# Altium project Gas Monitor.PrjPcb (part 1 of 2)
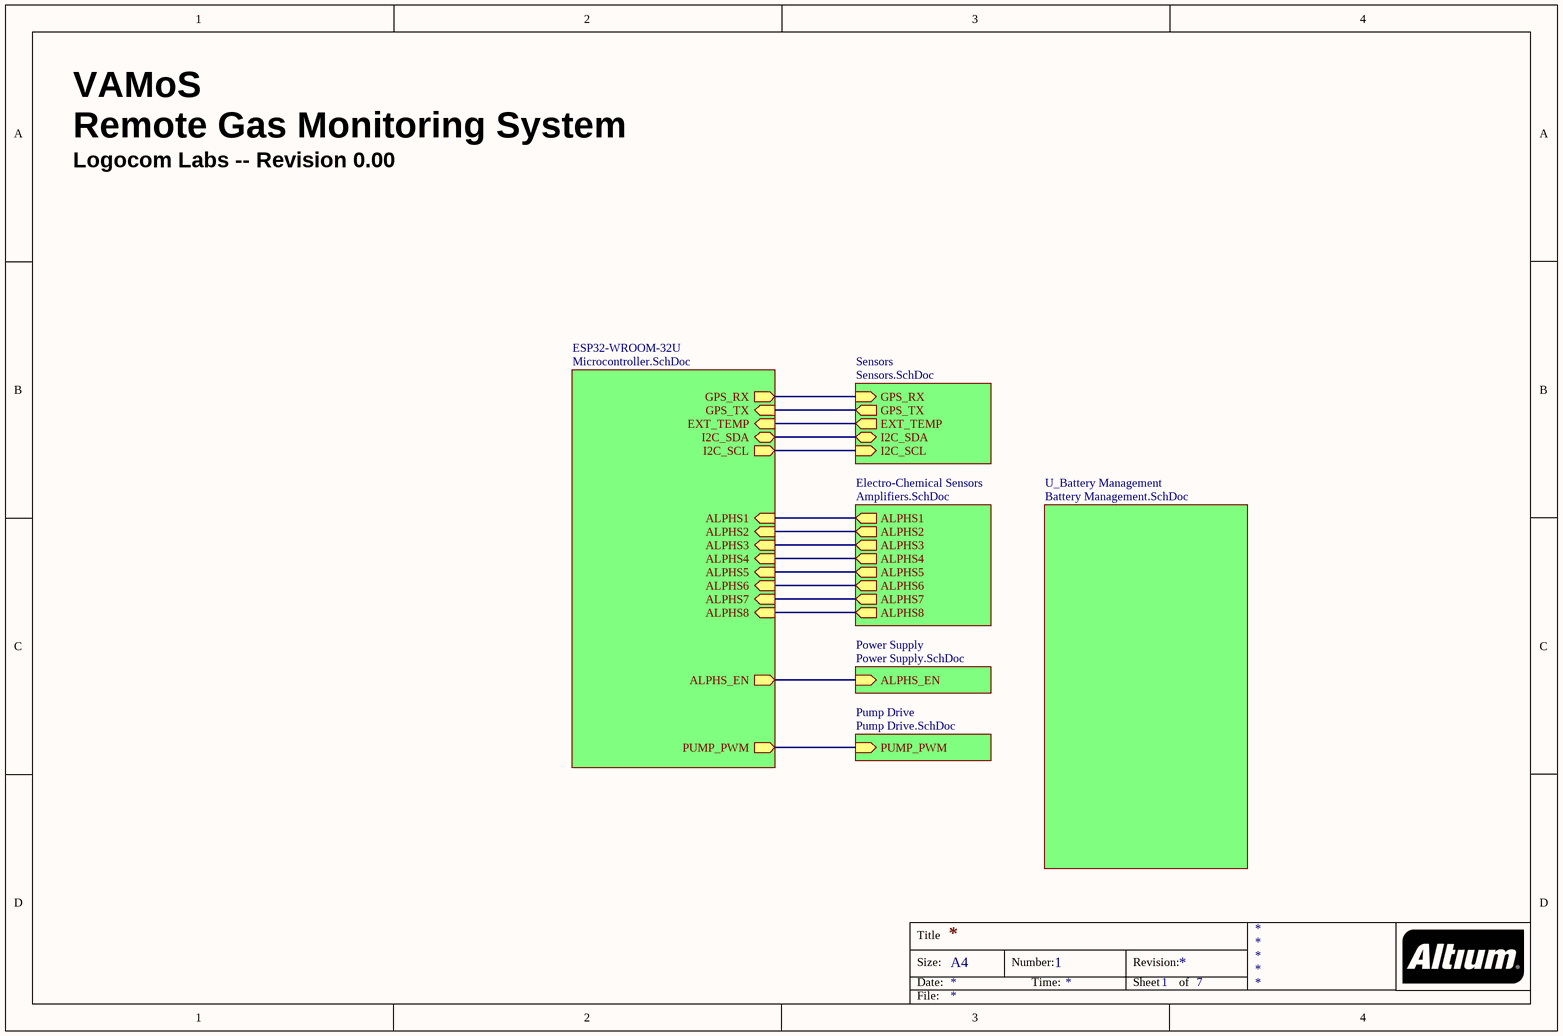
[diagram p0: VAMoS Top Sheet.SchDoc]
7 sheets, 294 parts. Net scope: hierarchical (ports join the sheet entries above them; power ports are global).
Board file: VAMoS Rev D.PcbDoc
Sheets:
  VAMoS Top Sheet.SchDoc
    Sensors = Sensors.SchDoc
    Electro-Chemical Sensors = Amplifiers.SchDoc
    Power Supply = Power Supply.SchDoc
    ESP32-WROOM-32U = Microcontroller.SchDoc
    Pump Drive = Pump Drive.SchDoc
    U_Battery Management = Battery Management.SchDoc

## Sheet VAMoS Top Sheet.SchDoc
size A4; DocumentNumber: 1; SheetNumber: 1; SheetTotal: 7

### Sub-sheets
Electro-Chemical Sensors = Amplifiers.SchDoc: ALPHS1 (out), ALPHS2 (out), ALPHS3 (out), ALPHS4 (out), ALPHS5 (out), ALPHS6 (out), ALPHS7 (out), ALPHS8 (out)
ESP32-WROOM-32U = Microcontroller.SchDoc: I2C_SDA (bidir), I2C_SCL (out), GPS_TX (in), GPS_RX (out), EXT_TEMP (in), ALPHS_EN (out), PUMP_PWM (out), ALPHS8 (in), ALPHS1 (in), ALPHS2 (in), ALPHS3 (in), ALPHS4 (in), ALPHS5 (in), ALPHS6 (in), ALPHS7 (in)
Power Supply = Power Supply.SchDoc: ALPHS_EN (in)
Pump Drive = Pump Drive.SchDoc: PUMP_PWM (in)
Sensors = Sensors.SchDoc: GPS_RX (in), GPS_TX (out), EXT_TEMP (out), I2C_SDA (bidir), I2C_SCL (in)
U_Battery Management = Battery Management.SchDoc: no entries

### Nets
ALPHS1: sheet Electro-Chemical Sensors/ALPHS1, sheet ESP32-WROOM-32U/ALPHS1
ALPHS2: sheet Electro-Chemical Sensors/ALPHS2, sheet ESP32-WROOM-32U/ALPHS2
ALPHS3: sheet Electro-Chemical Sensors/ALPHS3, sheet ESP32-WROOM-32U/ALPHS3
ALPHS4: sheet Electro-Chemical Sensors/ALPHS4, sheet ESP32-WROOM-32U/ALPHS4
ALPHS5: sheet Electro-Chemical Sensors/ALPHS5, sheet ESP32-WROOM-32U/ALPHS5
ALPHS6: sheet Electro-Chemical Sensors/ALPHS6, sheet ESP32-WROOM-32U/ALPHS6
ALPHS7: sheet Electro-Chemical Sensors/ALPHS7, sheet ESP32-WROOM-32U/ALPHS7
ALPHS8: sheet Electro-Chemical Sensors/ALPHS8, sheet ESP32-WROOM-32U/ALPHS8
ALPHS_EN: sheet Power Supply/ALPHS_EN, sheet ESP32-WROOM-32U/ALPHS_EN
EXT_TEMP: sheet Sensors/EXT_TEMP, sheet ESP32-WROOM-32U/EXT_TEMP
GPS_RX: sheet Sensors/GPS_RX, sheet ESP32-WROOM-32U/GPS_RX
GPS_TX: sheet Sensors/GPS_TX, sheet ESP32-WROOM-32U/GPS_TX
I2C_SCL: sheet Sensors/I2C_SCL, sheet ESP32-WROOM-32U/I2C_SCL
I2C_SDA: sheet Sensors/I2C_SDA, sheet ESP32-WROOM-32U/I2C_SDA
PUMP_PWM: sheet ESP32-WROOM-32U/PUMP_PWM, sheet Pump Drive/PUMP_PWM

### Notes on the sheet
- VAMoS
- Remote Gas Monitoring System
- Logocom Labs -- Revision 0.00
- Title
- Size:
- Date:
- A4
- Number:
- Time:
- Revision:
- Sheet
- of
- File:

## Sheet Sensors.SchDoc: Sensor Interfaces
size A4; DocumentNumber: 5; Revision: D; SheetNumber: 5; SheetTotal: 7
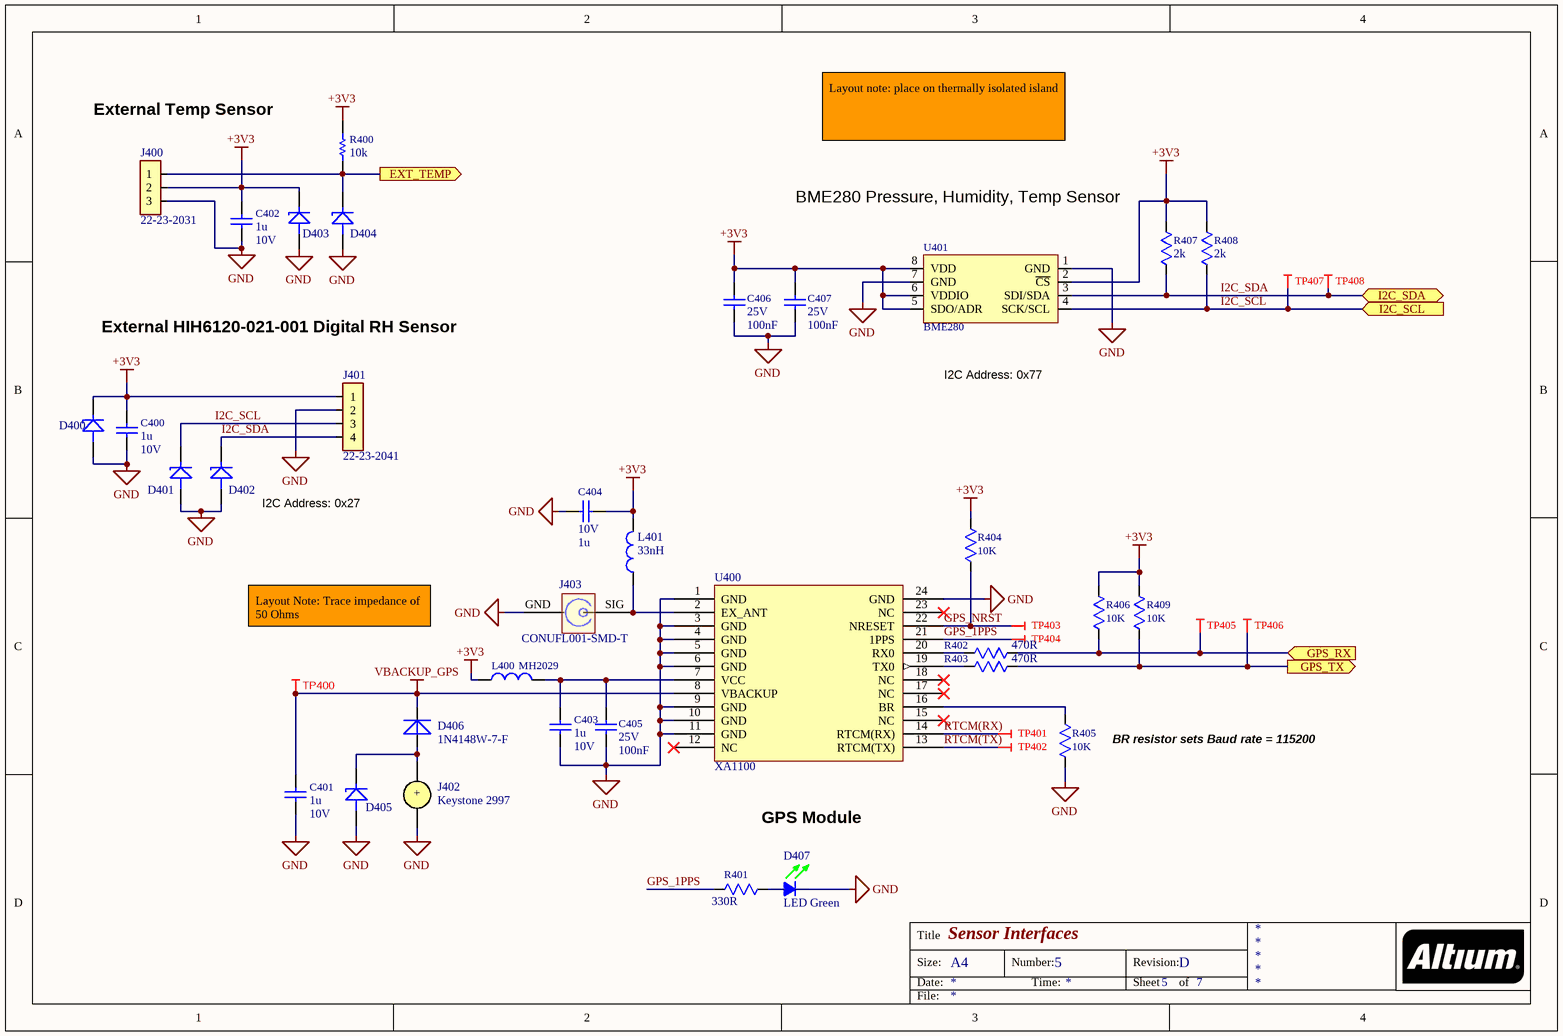
[diagram p1: Sensors.SchDoc]

### Parts
C400  value 1u  Voltage: 10V  [CAPC1005X06N]  (hidden comment: 4.7uF)
C401  value 1u  Voltage: 10V  [CAPC1005X06N]  (hidden comment: 4.7uF)
C402  value 1u  Voltage: 10V  [CAPC1005X06N]  (hidden comment: 4.7uF)
C403  value 1u  Voltage: 10V  [CAPC1005X06N]  (hidden comment: 4.7uF)
C404  value 1u  Voltage: 10V  [CAPC1005X06N]  (hidden comment: 4.7uF)
C405  value 100nF  Voltage: 25V  [CAPC1005X06N]  (hidden comment: 4.7uF)
C406  value 100nF  Voltage: 25V  [CAPC1005X06N]  (hidden comment: 4.7uF)
C407  value 100nF  Voltage: 25V  [CAPC1005X06N]  (hidden comment: 4.7uF)
D400  3.3V TVS  [NXP PTVSxS1UR-Series (SOD123W)]  (value not drawn)
D401  3.3V TVS  [NXP PTVSxS1UR-Series (SOD123W)]  (value not drawn)
D402  3.3V TVS  [NXP PTVSxS1UR-Series (SOD123W)]  (value not drawn)
D403  3.3V TVS  [NXP PTVSxS1UR-Series (SOD123W)]  (value not drawn)
D404  3.3V TVS  [NXP PTVSxS1UR-Series (SOD123W)]  (value not drawn)
D405  3.3V TVS  [NXP PTVSxS1UR-Series (SOD123W)]  (value not drawn)
D406  Manufacturer Part Number: 1N4148W-7-F  [SOD-123FL_TVS]  (hidden comment: 1N4148W-FDICT-ND)
D407  LED Green  [LED_0603]
J400  22-23-2031  [22-23-2031]
J401  22-23-2041  [22-23-2041]
J402  Keystone 2997  [2997 11.6mm COIN CELL]
J403  uFl Connector  [CONUFL001-SMD-T]  (value not drawn)
L400  MH2029  [L2012[0805]]
L401  33nH  [L1608[0603]]
R400  value 10k  [RESC1005X03N]  (hidden comment: RES: GENERAL)
R401  value 330R  [R1608[0603] small]  (hidden comment: 330)
R402  value 470R  [RESC1005X03N]  (hidden comment: 10K)
R403  value 470R  [RESC1005X03N]  (hidden comment: 10K)
R404  10K  [RESC1005X03N]
R405  10K  [RESC1005X03N]
R406  10K  [RESC1005X03N]
R407  value 2k  [R1005[0402]]  (hidden comment: 10K)
R408  value 2k  [R1005[0402]]  (hidden comment: 10K)
R409  10K  [RESC1005X03N]
TP400  PAD  [TP_SMD_39MIL]  (value not drawn)  (no BOM)
TP401  PAD  [TP_SMD_39MIL]  (value not drawn)  (no BOM)
TP402  PAD  [TP_SMD_39MIL]  (value not drawn)  (no BOM)
TP403  PAD  [TP_SMD_39MIL]  (value not drawn)  (no BOM)
TP404  PAD  [TP_SMD_45MIL]  (value not drawn)  (no BOM)
TP405  PAD  [TP_SMD_39MIL]  (value not drawn)  (no BOM)
TP406  PAD  [TP_SMD_39MIL]  (value not drawn)  (no BOM)
TP407  PAD  [TP_SMD_39MIL]  (value not drawn)  (no BOM)
TP408  PAD  [TP_SMD_39MIL]  (value not drawn)  (no BOM)
U400  XA1100  [XA1100]
U401  BME280  [BME280]

### Ports
EXT_TEMP (out), GPS_RX (in), GPS_TX (out), I2C_SCL (in), I2C_SDA (bidir)

### Nets
+3V3: C400.2 C402.2 C404.1 C406.2 C407.2 D400.1 D403.1 J400.2 J401.1 L400.1 L401.2 R400.2 R404.2 R406.2 R407.2 R408.2 R409.2 U401.2(~{CS}) U401.5(SDO/ADR) U401.6(VDDIO) U401.8(VDD)
GND: C400.1 C401.1 C402.1 C403.1 C404.2 C405.1 C406.1 C407.1 D400.2 D401.2 D402.2 D403.2 D404.2 D405.2 D407.2 J400.3 J401.2 J402.2 J403.GND R405.1 U400.1(GND) U400.3(GND) U400.4(GND) U400.5(GND) U400.6(GND) U400.9(GND) U400.10(GND) U400.11(GND) U400.24(GND) U401.1(GND) U401.7(GND)
VBACKUP_GPS: C401.2 D406.2 TP400.1 U400.8(VBACKUP)
EXT_TEMP: D404.1 J400.1 R400.1 ; port EXT_TEMP
GPS_1PPS: R401.2 TP404.1 U400.21(1PPS)
GPS_NRST: R404.1 TP403.1 U400.22(NRESET)
GPS_RX: R402.1 R406.1 TP405.1 ; port GPS_RX
GPS_TX: R403.1 R409.1 TP406.1 ; port GPS_TX
I2C_SCL: D401.1 J401.3 R408.1 TP407.1 U401.4(SCK/SCL) ; port I2C_SCL
I2C_SDA: D402.1 J401.4 R407.1 TP408.1 U401.3(SDI/SDA) ; port I2C_SDA
RTCM(RX): TP401.1 U400.14(RTCM(RX))
RTCM(TX): TP402.1 U400.13(RTCM(TX))
NetC403_2: C403.2 C405.2 L400.2 U400.7(VCC)
NetD405_1: D405.1 D406.1 J402.1(+)
NetD407_1: D407.1 R401.1
NetJ403_SIG: J403.SIG L401.1 U400.2(EX_ANT)
NetR402_2: R402.2 U400.20(RX0)
NetR403_2: R403.2 U400.19(TX0)
NetR405_2: R405.2 U400.16(BR)

Not connected (* = marked no-connect by the designer): U400 12(NC)* 15(NC)* 17(NC)* 18(NC)* 23(NC)*

### Notes on the sheet
- External Temp Sensor
- Layout note: place on thermally isolated island
- BME280 Pressure, Humidity, Temp Sensor
- External HIH6120-021-001 Digital RH Sensor
- I2C Address: 0x77
- I2C Address: 0x27
- Layout Note: Trace impedance of 50 Ohms
- (near R405) BR resistor sets Baud rate = 115200
- GPS Module
- Title
- Size:
- Date:
- A4
- Number:
- Time:
- Revision:
- Sheet
- of
- File:

### Library data of the parts
C400-C404 = 4.7uF_0603_10V: CAP 4.7uF 10V ±10% X5R 0603; Manufacturer Part Number: CL05A105MP5NNNC; Manufacturer: Samsung; ComponentLink1URL: http://www.murata.com/~/media/webrenewal/support/library/catalog/products/capacitor/mlcc/c02e.pdf; ComponentLink1Description: http://www.murata.com/~/media/webrenewal/support/library/catalog/products/capacitor/mlcc/c02e.pdf; Supplier Part Number 1: 1276-1448-1-ND; Supplier 1: Digi-Key
C405-C407 = 4.7uF_0603_10V: Manufacturer Part Number: CL05A104KA5NNNC; Manufacturer: Samsung; ComponentLink1URL: http://www.murata.com/~/media/webrenewal/support/library/catalog/products/capacitor/mlcc/c02e.pdf; ComponentLink1Description: http://www.murata.com/~/media/webrenewal/support/library/catalog/products/capacitor/mlcc/c02e.pdf; Supplier 1: Digi-Key; Supplier Part Number 1: 1276-1043-1-ND
D400-D405 = NXP PTVSxS1UR-Series: Manufacturer: Nexperia; Manufacturer Part Number: PTVS3V3S1UTR,115; Supplier 1: Digi-Key; Supplier Part Number 1: 1727-1416-1-ND
D406 = Diode 300mA Gen Purp: 300mA General Purpose; Manufacturer: Diodes Incorporated; Supplier Part Number 1: 1N4148W-FDICT-ND; Supplier 1: Digi-Key
D407 = Green LED: LED Green Diffused 0603; Manufacturer: Rohm; Manufacturer Part Number: SML-D12M8WT86; TZOA PN: XXX; Intensity: 100 mcd; Forward (Drive) Current: 20 mA; Forward Voltage: 2.2 V; Supplier 1: Digi-Key; Stock 1: 105158; Pricing 1: 1=0.34, 10=0.251, 25=0.1848, 100=0.132, 250=0.0898, 500=0.0792, 1000=0.062 (USD); Color: Green; Dimension: 0603; Lens Type: Diffused; ComponentLink1URL: https://datasheet.ciiva.com/11774/0900766b80df3ada-11774260.pdf; ComponentLink1Description: https://datasheet.ciiva.com/11774/0900766b80df3ada-11774260.pdf; ComponentLink2URL: https://datasheet.ciiva.com/3161/sml-d1-3161419.pdf; ComponentLink2Description: https://datasheet.ciiva.com/3161/sml-d1-3161419.pdf; ComponentLink3URL: https://datasheet.ciiva.com/2110/sml-d1-2110396.pdf; ComponentLink3Description: https://datasheet.ciiva.com/2110/sml-d1-2110396.pdf; ComponentLink4URL: https://datasheet.ciiva.com/2110/sml-d1-2110397.pdf; ComponentLink4Description: https://datasheet.ciiva.com/2110/sml-d1-2110397.pdf; ComponentLink5URL: https://datasheet.ciiva.com/2110/sml-d1-2110398.pdf; ComponentLink5Description: https://datasheet.ciiva.com/2110/sml-d1-2110398.pdf; Supplier Part Number 1: 511-1578-1-ND
J400 = 22-23-2031: Connector Header Through Hole 3 position 0.100" (2.54mm); Manufacturer: Molex; Manufacturer Part Number: 0022232031; Value: *; Supplier Part Number 1: WM4201-ND; Supplier 1: Digi-Key
J401 = 22-23-2041: Connector Header Through Hole 4 position 0.100" (2.54mm); Manufacturer: Molex; Manufacturer Part Number: 0022232041; Value: *; Supplier Part Number 1: WM4202-ND; Supplier 1: Digi-Key
J402 = 30mm Coin Cell Holder: DigiKey # 36-2997-ND; Manufacturer: Keystone Electronics; Manufacturer Part Number: 2997; Supplier 1: Digi-Key; Supplier Part Number 1: 36-2997-ND
J403 = uFl Connector: CONUFL001-SMD-T; Manufacturer: Linx Technologies; Supplier 1: Digi-Key; Manufacturer Part Number: CONUFL001-SMD-T; Supplier Part Number 1: CONUFL001-SMD-TCT-ND
L400 = Ferrite_MH2029_0805: Ferrite,SMD,3A,30Ohm,0805; Manufacturer: Bourns Inc.; Manufacturer Part Number: MH2029-300Y; Filter Type: Power, Signal Line; Number of Lines: 1; Impedance @ Frequency: 30 Ohm @ 100MHz; DC Resistance (DCR) (Max): 25 mOhm; ID: 1851582; Supplier 1: Digi-Key; Supplier Part Number 1: MH2029-300YCT-ND; RoHS: RoHS Compliant; Category: Filters; Stock: 27744; Pricing: 1=0.14, 10=0.087, 25=0.08, 50=0.072, 100=0.0529, 250=0.03844, 500=0.03524, 1000=0.03043 (CAD); Packaging: Cut Tape (CT); Current Rating (Max): 3A; Ratings: -; Operating Temperature: -55°C ~ 125°C; Package / Case: 0805 (2012 Metric); Mounting Type: Surface Mount; Height (Max): 0.043" (1.10mm); Size / Dimension: 0.079" L x 0.047" W (2.00mm x 1.20mm); ComponentLink1URL: http://www.bourns.com/docs/Product-Datasheets/mh.pdf; ComponentLink1Description: http://www.bourns.com/docs/Product-Datasheets/mh.pdf; Supplier 2: Arrow; Supplier Part Number 2: m2dWQtYZmUCQVruAmfTV4mDHm8tZpH9KPPdphe4ib-E; Package Quantity: 1; ComponentLink2URL: https://www.arrow.com/en/products/mh2029-300y/bourns/; ComponentLink2Description: https://www.arrow.com/en/products/mh2029-300y/bourns/
L401 = Inductor_33nH: Fixed Inductor,SMD,33nH,550mA,132mOhmDCR,2.5GHz,0603; Manufacturer: Murata; Manufacturer Part Number: LQW18AN33NJ10D; Value: 33n; Supplier 1: Digi-Key; Supplier Part Number 1: 490-6885-1-ND
R400 = RES: GENERAL: Manufacturer: Panasonic; Manufacturer Part Number: ERJ-2RKF1002X; Accuracy: *; Distributor Part Number: *; Power: *; Type: *; Distributor: Digi-Key; Package: *; Supplier 1: Digi-Key; Supplier Part Number 1: P10.0KLCT-ND
R401 = 1K00_0603_0.1W: RES 1K Ohm ±5%, 0.25W,1/4W 0603; Manufacturer: Rohm; Manufacturer Part Number: RC0603FR-07330RL; Supplier 1: Digi-Key; Resistance (Ohms): 1k; ComponentLink1URL: https://datasheet.ciiva.com/2469/esr-2469603.pdf; ComponentLink1Description: https://datasheet.ciiva.com/2469/esr-2469603.pdf; ComponentLink2URL: https://datasheet.ciiva.com/2469/esr-2469604.pdf; ComponentLink2Description: https://datasheet.ciiva.com/2469/esr-2469604.pdf; ComponentLink3URL: https://datasheet.ciiva.com/2469/esr-2469605.pdf; ComponentLink3Description: https://datasheet.ciiva.com/2469/esr-2469605.pdf; Supplier Part Number 1: 311-330HRCT-ND
R402 R403 = 1K00_0603_0.1W: RES 1K Ohm ±5%, 0.25W,1/4W 0603; Manufacturer: Panasonic; Manufacturer Part Number: ERJ-2RKF4700X; ComponentLink1URL: https://datasheet.ciiva.com/2469/esr-2469603.pdf; ComponentLink1Description: https://datasheet.ciiva.com/2469/esr-2469603.pdf; ComponentLink2URL: https://datasheet.ciiva.com/2469/esr-2469604.pdf; ComponentLink2Description: https://datasheet.ciiva.com/2469/esr-2469604.pdf; ComponentLink3URL: https://datasheet.ciiva.com/2469/esr-2469605.pdf; ComponentLink3Description: https://datasheet.ciiva.com/2469/esr-2469605.pdf; Supplier 1: Digi-Key; Supplier Part Number 1: P470LCT-ND
R404-R406 R409 = 1K00_0603_0.1W: RES 1K Ohm ±5%, 0.25W,1/4W 0603; Manufacturer: Panasonic; Manufacturer Part Number: ERJ-2RKF1002X; ComponentLink1URL: https://datasheet.ciiva.com/2469/esr-2469603.pdf; ComponentLink1Description: https://datasheet.ciiva.com/2469/esr-2469603.pdf; ComponentLink2URL: https://datasheet.ciiva.com/2469/esr-2469604.pdf; ComponentLink2Description: https://datasheet.ciiva.com/2469/esr-2469604.pdf; ComponentLink3URL: https://datasheet.ciiva.com/2469/esr-2469605.pdf; ComponentLink3Description: https://datasheet.ciiva.com/2469/esr-2469605.pdf; Supplier 1: Digi-Key; Supplier Part Number 1: P10.0KLCT-ND; Value: 10k
R407 R408 = 1K00_0603_0.1W: Manufacturer: Panasonic; Manufacturer Part Number: ERJ-2RKF2001X; Supplier 1: Digi-Key; ComponentLink1URL: https://datasheet.ciiva.com/2469/esr-2469603.pdf; ComponentLink1Description: https://datasheet.ciiva.com/2469/esr-2469603.pdf; ComponentLink2URL: https://datasheet.ciiva.com/2469/esr-2469604.pdf; ComponentLink2Description: https://datasheet.ciiva.com/2469/esr-2469604.pdf; ComponentLink3URL: https://datasheet.ciiva.com/2469/esr-2469605.pdf; ComponentLink3Description: https://datasheet.ciiva.com/2469/esr-2469605.pdf; Supplier Part Number 1: P2.00KLDKR-ND
TP400-TP403 TP405-TP408 = TP_SMD_39MIL: SMD Test Pad; Manufacturer: No P/N Required; P/N: No P/N; UM: EA; Fast Supplier: No P/N Required; Fast Supplier P/N: No P/N Required; Manufacturer P/N: No P/N Required
TP404 = TP_SMD_45MIL: SMD Test Pad; Manufacturer: No P/N Required; P/N: No P/N; UM: EA; Fast Supplier: No P/N Required; Fast Supplier P/N: No P/N Required; Manufacturer P/N: No P/N Required
U400 = XA1100: GPS Module; Manufacturer Part Number: XA1100_1103872; Manufacturer: Sierra Wireless; Supplier Part Number 1: 1645-1094-1-ND; Supplier 1: Digi-Key
U401 = BME280: SENSOR Humidity Temperature 0 ~ 100% RH I²C SPI ±3% 1s 8-Pin LGA; Manufacturer: Bosch; Supplier 1: Digi-Key; Manufacturer Part Number: BME280; Supplier Part Number 1: 828-1063-1-ND

## Sheet Amplifiers.SchDoc: Electrochemical Sensor Input
size A4; DocumentNumber: 2; Revision: D; SheetNumber: 2; SheetTotal: 7
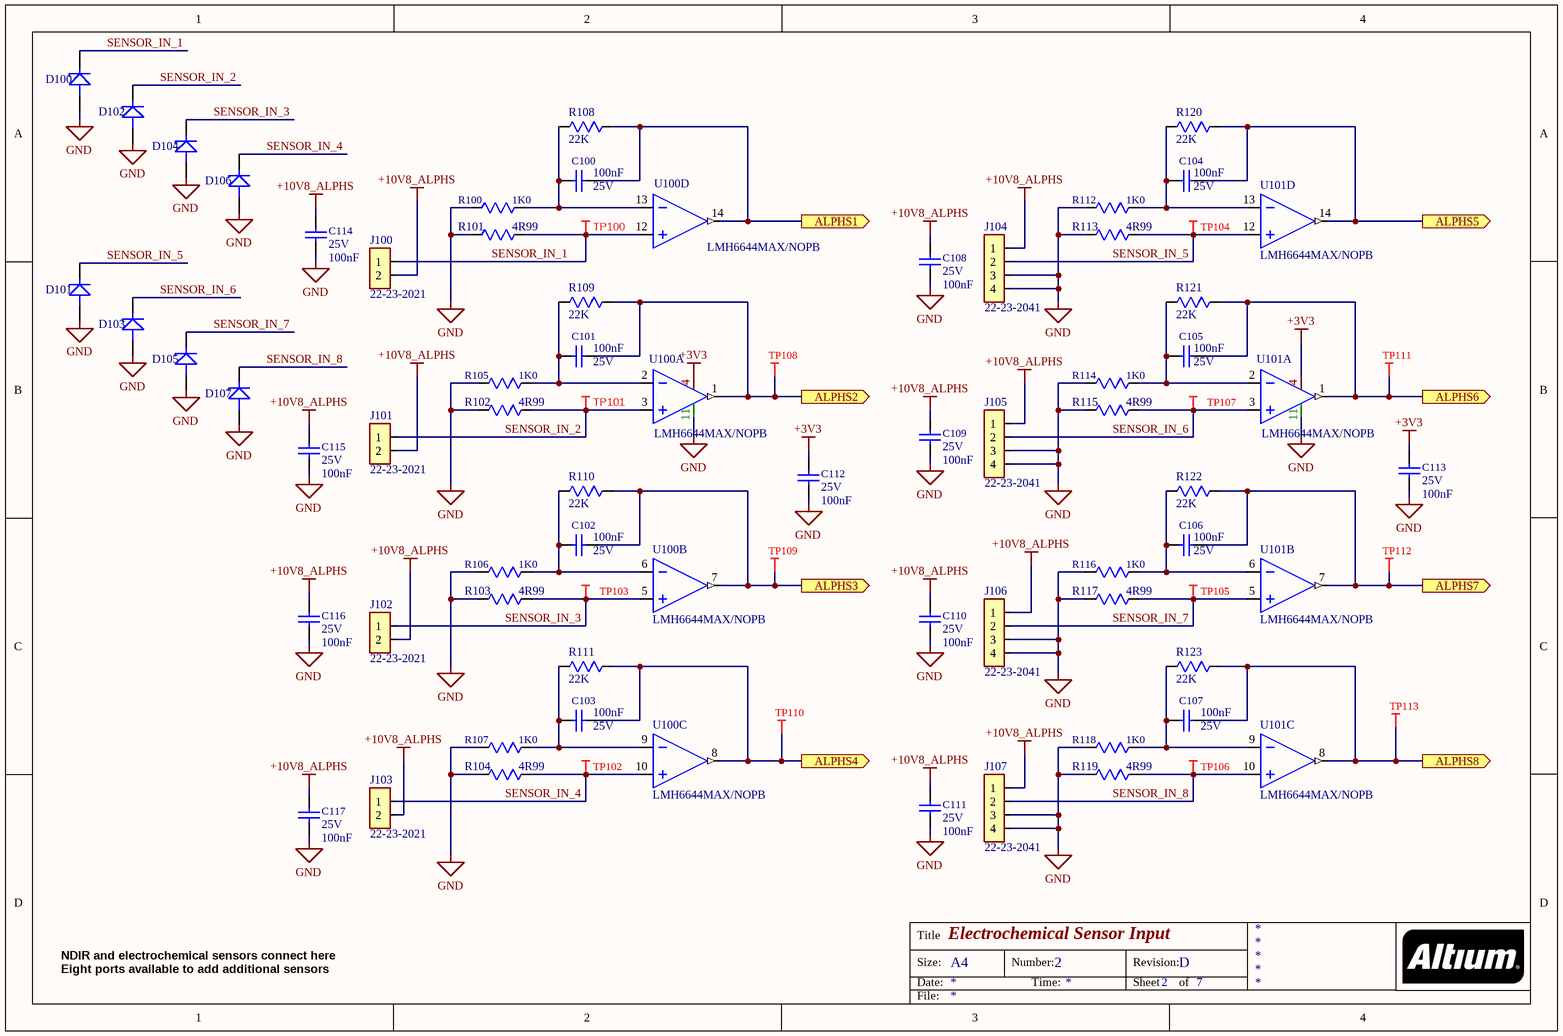
[diagram p2: Amplifiers.SchDoc]

### Parts
C100  value 100nF  Voltage: 25V  [CAPC1005X06N]  (hidden comment: 4.7uF)
C101  value 100nF  Voltage: 25V  [CAPC1005X06N]  (hidden comment: 4.7uF)
C102  value 100nF  Voltage: 25V  [CAPC1005X06N]  (hidden comment: 4.7uF)
C103  value 100nF  Voltage: 25V  [CAPC1005X06N]  (hidden comment: 4.7uF)
C104  value 100nF  Voltage: 25V  [CAPC1005X06N]  (hidden comment: 4.7uF)
C105  value 100nF  Voltage: 25V  [CAPC1005X06N]  (hidden comment: 4.7uF)
C106  value 100nF  Voltage: 25V  [CAPC1005X06N]  (hidden comment: 4.7uF)
C107  value 100nF  Voltage: 25V  [CAPC1005X06N]  (hidden comment: 4.7uF)
C108  value 100nF  Voltage: 25V  [CAPC1005X06N]  (hidden comment: 4.7uF)
C109  value 100nF  Voltage: 25V  [CAPC1005X06N]  (hidden comment: 4.7uF)
C110  value 100nF  Voltage: 25V  [CAPC1005X06N]  (hidden comment: 4.7uF)
C111  value 100nF  Voltage: 25V  [CAPC1005X06N]  (hidden comment: 4.7uF)
C112  value 100nF  Voltage: 25V  [CAPC1005X06N]  (hidden comment: 4.7uF)
C113  value 100nF  Voltage: 25V  [CAPC1005X06N]  (hidden comment: 4.7uF)
C114  value 100nF  Voltage: 25V  [CAPC1005X06N]  (hidden comment: 4.7uF)
C115  value 100nF  Voltage: 25V  [CAPC1005X06N]  (hidden comment: 4.7uF)
C116  value 100nF  Voltage: 25V  [CAPC1005X06N]  (hidden comment: 4.7uF)
C117  value 100nF  Voltage: 25V  [CAPC1005X06N]  (hidden comment: 4.7uF)
D100  5V TVS  [NXP PTVSxS1UR-Series (SOD123W)]  (value not drawn)
D101  5V TVS  [NXP PTVSxS1UR-Series (SOD123W)]  (value not drawn)
D102  5V TVS  [NXP PTVSxS1UR-Series (SOD123W)]  (value not drawn)
D103  5V TVS  [NXP PTVSxS1UR-Series (SOD123W)]  (value not drawn)
D104  5V TVS  [NXP PTVSxS1UR-Series (SOD123W)]  (value not drawn)
D105  5V TVS  [NXP PTVSxS1UR-Series (SOD123W)]  (value not drawn)
D106  5V TVS  [NXP PTVSxS1UR-Series (SOD123W)]  (value not drawn)
D107  5V TVS  [NXP PTVSxS1UR-Series (SOD123W)]  (value not drawn)
J100  22-23-2021  [22-23-2021]
J101  22-23-2021  [22-23-2021]
J102  22-23-2021  [22-23-2021]
J103  22-23-2021  [22-23-2021]
J104  22-23-2041  [22-23-2041]
J105  22-23-2041  [22-23-2041]
J106  22-23-2041  [22-23-2041]
J107  22-23-2041  [22-23-2041]
R100  1K0  [RESC1005X03N]
R101  4R99  [RESC1005X03N]
R102  4R99  [RESC1005X03N]
R103  4R99  [RESC1005X03N]
R104  4R99  [RESC1005X03N]
R105  1K0  [RESC1005X03N]
R106  1K0  [RESC1005X03N]
R107  1K0  [RESC1005X03N]
R108  22K  [RESC1005X03N]
R109  22K  [RESC1005X03N]
R110  22K  [RESC1005X03N]
R111  22K  [RESC1005X03N]
R112  1K0  [RESC1005X03N]
R113  4R99  [RESC1005X03N]
R114  1K0  [RESC1005X03N]
R115  4R99  [RESC1005X03N]
R116  1K0  [RESC1005X03N]
R117  4R99  [RESC1005X03N]
R118  1K0  [RESC1005X03N]
R119  4R99  [RESC1005X03N]
R120  22K  [RESC1005X03N]
R121  22K  [RESC1005X03N]
R122  22K  [RESC1005X03N]
R123  22K  [RESC1005X03N]
TP100  PAD  [TP_SMD_39MIL]  (value not drawn)  (no BOM)
TP101  PAD  [TP_SMD_39MIL]  (value not drawn)  (no BOM)
TP102  PAD  [TP_SMD_39MIL]  (value not drawn)  (no BOM)
TP103  PAD  [TP_SMD_39MIL]  (value not drawn)  (no BOM)
TP104  PAD  [TP_SMD_39MIL]  (value not drawn)  (no BOM)
TP105  PAD  [TP_SMD_39MIL]  (value not drawn)  (no BOM)
TP106  PAD  [TP_SMD_39MIL]  (value not drawn)  (no BOM)
TP107  PAD  [TP_SMD_39MIL]  (value not drawn)  (no BOM)
TP108  PAD  [TP_SMD_39MIL]  (value not drawn)  (no BOM)
TP109  PAD  [TP_SMD_39MIL]  (value not drawn)  (no BOM)
TP110  PAD  [TP_SMD_39MIL]  (value not drawn)  (no BOM)
TP111  PAD  [TP_SMD_39MIL]  (value not drawn)  (no BOM)
TP112  PAD  [TP_SMD_39MIL]  (value not drawn)  (no BOM)
TP113  PAD  [TP_SMD_39MIL]  (value not drawn)  (no BOM)
U100  LMH6644MAX/NOPB  [SOIC-14]  (parts A,B,C,D of 4)
U101  LMH6644MAX/NOPB  [SOIC-14]  (parts A,B,C,D of 4)

### Ports
ALPHS1 (out), ALPHS2 (out), ALPHS3 (out), ALPHS4 (out), ALPHS5 (out), ALPHS6 (out), ALPHS7 (out), ALPHS8 (out)

### Nets
+3V3: C112.2 C113.2 U100.4(Vdd) U101.4(Vdd)
+10V8_ALPHS: C108.2 C109.2 C110.2 C111.2 C114.2 C115.2 C116.2 C117.2 J100.2 J101.2 J102.2 J103.2 J104.1 J105.1 J106.1 J107.1
GND: C108.1 C109.1 C110.1 C111.1 C112.1 C113.1 C114.1 C115.1 C116.1 C117.1 D100.2 D101.2 D102.2 D103.2 D104.2 D105.2 D106.2 D107.2 J104.3 J104.4 J105.3 J105.4 J106.3 J106.4 J107.3 J107.4 R100.1 R101.1 R102.1 R103.1 R104.1 R105.1 R106.1 R107.1 R112.1 R113.1 R114.1 R115.1 R116.1 R117.1 R118.1 R119.1 U100.11(Vss) U101.11(Vss)
ALPHS1: C100.2 R108.2 U100.14(OutD) ; port ALPHS1
ALPHS2: C101.2 R109.2 TP108.1 U100.1(OutA) ; port ALPHS2
ALPHS3: C102.2 R110.2 TP109.1 U100.7(OutB) ; port ALPHS3
ALPHS4: C103.2 R111.2 TP110.1 U100.8(OutC) ; port ALPHS4
ALPHS5: C104.2 R120.2 U101.14(OutD) ; port ALPHS5
ALPHS6: C105.2 R121.2 TP111.1 U101.1(OutA) ; port ALPHS6
ALPHS7: C106.2 R122.2 TP112.1 U101.7(OutB) ; port ALPHS7
ALPHS8: C107.2 R123.2 TP113.1 U101.8(OutC) ; port ALPHS8
SENSOR_IN_1: D100.1 J100.1 R101.2 TP100.1 U100.12(+InD)
SENSOR_IN_2: D102.1 J101.1 R102.2 TP101.1 U100.3(+InA)
SENSOR_IN_3: D104.1 J102.1 R103.2 TP103.1 U100.5(+InB)
SENSOR_IN_4: D106.1 J103.1 R104.2 TP102.1 U100.10(+InC)
SENSOR_IN_5: D101.1 J104.2 R113.2 TP104.1 U101.12(+InD)
SENSOR_IN_6: D103.1 J105.2 R115.2 TP107.1 U101.3(+InA)
SENSOR_IN_7: D105.1 J106.2 R117.2 TP105.1 U101.5(+InB)
SENSOR_IN_8: D107.1 J107.2 R119.2 TP106.1 U101.10(+InC)
NetC100_1: C100.1 R100.2 R108.1 U100.13(-InD)
NetC101_1: C101.1 R105.2 R109.1 U100.2(-InA)
NetC102_1: C102.1 R106.2 R110.1 U100.6(-InB)
NetC103_1: C103.1 R107.2 R111.1 U100.9(-InC)
NetC104_1: C104.1 R112.2 R120.1 U101.13(-InD)
NetC105_1: C105.1 R114.2 R121.1 U101.2(-InA)
NetC106_1: C106.1 R116.2 R122.1 U101.6(-InB)
NetC107_1: C107.1 R118.2 R123.1 U101.9(-InC)

### Notes on the sheet
- NDIR and electrochemical sensors connect here
- Eight ports available to add additional sensors
- Title
- Size:
- Date:
- A4
- Number:
- Time:
- Revision:
- Sheet
- of
- File:

### Library data of the parts
C100-C117 = 4.7uF_0603_10V: as C405 on sheet Sensors; ComponentLink1URL: http://www.murata.com/~/media/webrenewal/support/library/catalog/products/capacitor/mlcc/c02e.pdf; ComponentLink1Description: http://www.murata.com/~/media/webrenewal/support/library/catalog/products/capacitor/mlcc/c02e.pdf; Supplier 1: Digi-Key; Supplier Part Number 1: 1276-1043-1-ND
D100-D107 = NXP PTVSxS1UR-Series: Manufacturer: Nexperia; Manufacturer Part Number: PTVS5V0S1UR,115; Supplier 1: Digi-Key; Supplier Part Number 1: 1727-5229-1-ND
J100-J103 = 22-23-2021: CONN HEADER VERT 2POS 2.54MM; Manufacturer: Molex; Value: *; Supplier Part Number 1: WM4200-ND; Supplier 1: Digi-Key; Manufacturer Part Number: 22-23-2021
J104-J107 = 22-23-2041: as J401 on sheet Sensors; Value: *; Supplier Part Number 1: WM4202-ND; Supplier 1: Digi-Key
R100 R105-R107 R112 R114 R116 R118 = 1K00_0603_0.1W: RES 1K Ohm ±5%, 0.25W,1/4W 0603; Manufacturer: Panasonic; Manufacturer Part Number: ERJ-2RKF1001X; ComponentLink1URL: https://datasheet.ciiva.com/2469/esr-2469603.pdf; ComponentLink1Description: https://datasheet.ciiva.com/2469/esr-2469603.pdf; ComponentLink2URL: https://datasheet.ciiva.com/2469/esr-2469604.pdf; ComponentLink2Description: https://datasheet.ciiva.com/2469/esr-2469604.pdf; ComponentLink3URL: https://datasheet.ciiva.com/2469/esr-2469605.pdf; ComponentLink3Description: https://datasheet.ciiva.com/2469/esr-2469605.pdf; Supplier Part Number 1: P1.00KLCT-ND; Supplier 1: Digi-Key; Value: 1k
R101-R104 R113 R115 R117 R119 = 4R99_0603_1/4W: Res,SMD,4R99,1/4W,5%; Manufacturer: Stackpole; Manufacturer Part Number: RMCF0402FT4R99; Supplier Part Number 1: RMCF0402FT4R99CT-ND; Supplier 1: Digi-Key; Value: 4R99
R108-R111 R120-R123 = 22K_0603_1/4W: Res,SMD,22k,0603,5%,1/4W; Manufacturer Part Number: ERJ-2RKF2202X; Manufacturer: Panasonic; Supplier Part Number 1: P22.0KLDKR-ND; Supplier 1: Digi-Key; Value: 22k
TP100-TP113 = TP_SMD_39MIL: as TP400 on sheet Sensors; Fast Supplier: No P/N Required; Fast Supplier P/N: No P/N Required; Manufacturer P/N: No P/N Required
U100 U101 = LM660: Quad opamplifiers; Manufacturer: Texas Instruments; Supplier 1: Digi-Key; Supplier Part Number 1: 296-35336-1-ND; Manufacturer Part Number: LMH6644MAX/NOPB

## Sheet Power Supply.SchDoc: Power Supplies
size A4; DocumentNumber: 4; Revision: D; SheetNumber: 4; SheetTotal: 7
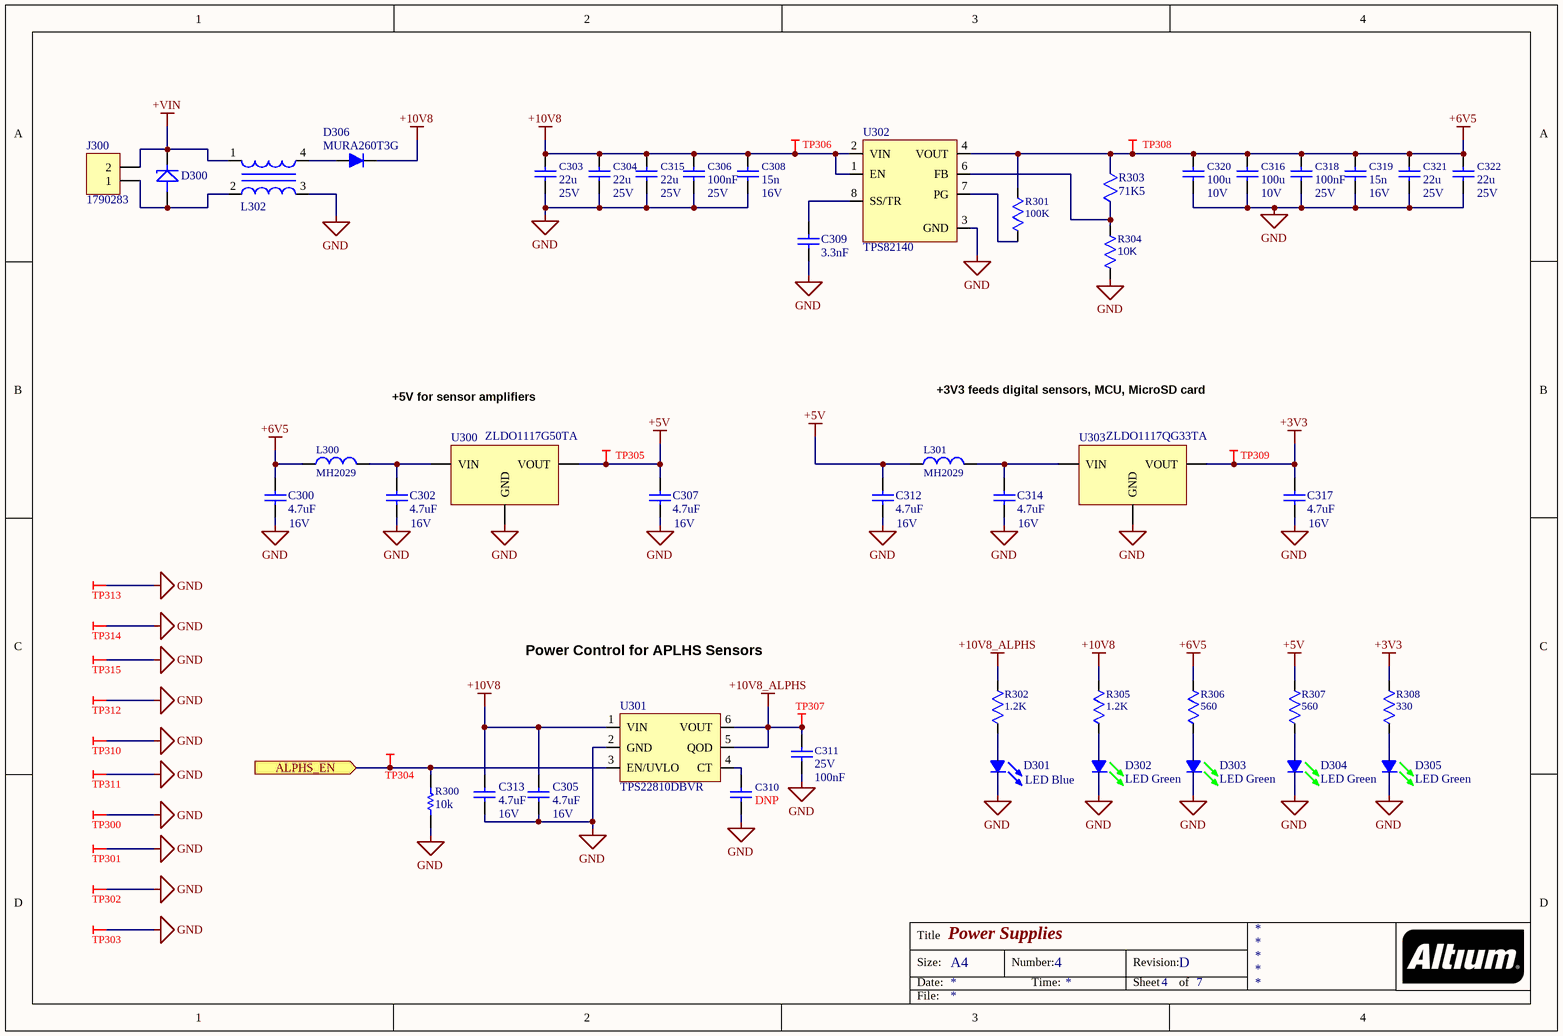
[diagram p3: Power Supply.SchDoc]

### Parts
C300  4.7uF  Voltage: 16V  [C1005[0402]]
C302  4.7uF  Voltage: 16V  [C1005[0402]]
C303  value 22u  Voltage: 25V  [CAPC2012X14N]
C304  value 22u  Voltage: 25V  [CAPC2012X14N]
C305  4.7uF  Voltage: 16V  [C1005[0402]]
C306  value 100nF  Voltage: 25V  [CAPC1005X06N]  (hidden comment: 4.7uF)
C307  4.7uF  Voltage: 16V  [C1005[0402]]
C308  value 15n  Voltage: 16V  [CAPC1005X06N]  (hidden comment: 4.7uF)
C309  3.3nF  [C1608[0603]]
C310  value DNP  [CAPC1005X06N]  (hidden comment: 4.7uF)
C311  value 100nF  Voltage: 25V  [CAPC1005X06N]  (hidden comment: 4.7uF)
C312  4.7uF  Voltage: 16V  [C1005[0402]]
C313  4.7uF  Voltage: 16V  [C1005[0402]]
C314  4.7uF  Voltage: 16V  [C1005[0402]]
C315  value 22u  Voltage: 25V  [CAPC2012X14N]
C316  value 100u  Voltage: 10V  [C3225[1210]_Tall]  (hidden comment: 4.7uF)
C317  4.7uF  Voltage: 16V  [C1005[0402]]
C318  value 100nF  Voltage: 25V  [CAPC1005X06N]  (hidden comment: 4.7uF)
C319  value 15n  Voltage: 16V  [CAPC1005X06N]  (hidden comment: 4.7uF)
C320  value 100u  Voltage: 10V  [C3225[1210]_Tall]  (hidden comment: 4.7uF)
C321  value 22u  Voltage: 25V  [CAPC2012X14N]
C322  value 22u  Voltage: 25V  [CAPC2012X14N]
D300  12V TVS  [NXP PTVSxS1UR-Series (SOD123W)]  (value not drawn)
D301  SMLE12BC7TT86  [LED_0603]  (value not drawn)
D302  LED Green  [LED_0603]
D303  LED Green  [LED_0603]
D304  LED Green  [LED_0603]
D305  LED Green  [LED_0603]
D306  MURA260T3G  [Diode SMA DIOM5226X240N]
J300  1790283  [5.08mm 2pos TermBlock]
L300  MH2029  [L2012[0805]]
L301  MH2029  [L2012[0805]]
L302  CM3421Y600R-10  [CM3421Y600R-10]  (value not drawn)
R300  value 10k  [RESC1005X03N]  (hidden comment: RES: GENERAL)
R301  100K  [RESC1005X03N]
R302  1.2K  [R1608[0603] small]
R303  71K5  [RESC1005X03N]
R304  10K  [RESC1005X03N]
R305  1.2K  [R1608[0603] small]
R306  560  [R1608[0603] small]
R307  560  [R1608[0603] small]
R308  330  [R1608[0603] small]
TP300  PAD  [TP_SMD_39MIL]  (value not drawn)  (no BOM)
TP301  PAD  [TP_SMD_39MIL]  (value not drawn)  (no BOM)
TP302  PAD  [TP_SMD_39MIL]  (value not drawn)  (no BOM)
TP303  PAD  [TP_SMD_39MIL]  (value not drawn)  (no BOM)
TP304  PAD  [TP_SMD_39MIL]  (value not drawn)  (no BOM)
TP305  PAD  [TP_SMD_39MIL]  (value not drawn)  (no BOM)
TP306  PAD  [TP_SMD_39MIL]  (value not drawn)  (no BOM)
TP307  PAD  [TP_SMD_39MIL]  (value not drawn)  (no BOM)
TP308  PAD  [TP_SMD_39MIL]  (value not drawn)  (no BOM)
TP309  PAD  [TP_SMD_39MIL]  (value not drawn)  (no BOM)
TP310  PAD  [TP_SMD_39MIL]  (value not drawn)  (no BOM)
TP311  PAD  [TP_SMD_39MIL]  (value not drawn)  (no BOM)
TP312  PAD  [TP_SMD_39MIL]  (value not drawn)  (no BOM)
TP313  PAD  [TP_SMD_39MIL]  (value not drawn)  (no BOM)
TP314  PAD  [TP_SMD_39MIL]  (value not drawn)  (no BOM)
TP315  PAD  [TP_SMD_39MIL]  (value not drawn)  (no BOM)
U300  ZLDO1117G50TA  [SOT230P700X165-4N]
U301  TPS22810DBVR  [SOT23]
U302  TPS82140  [SIL0008D]
U303  ZLDO1117QG33TA  [SOT230P700X165-4N]

### Ports
ALPHS_EN (in)

### Nets
+3V3: C317.2 R308.2 TP309.1 U303.2(VOUT)
+5V: C307.2 C312.2 L301.1 R307.2 TP305.1 U300.2(VOUT)
+6V5: C300.2 C316.1 C318.1 C319.1 C320.1 C321.1 C322.1 L300.1 R301.2 R303.2 R306.2 TP308.1 U302.4(VOUT)
+10V8: C303.1 C304.1 C305.2 C306.1 C308.1 C313.2 C315.1 D306.1(K) R305.2 TP306.1 U301.1(VIN) U302.1(EN) U302.2(VIN)
+10V8_ALPHS: C311.1 R302.2 TP307.1 U301.5(QOD) U301.6(VOUT)
+VIN: D300.1 J300.2 L302.1
GND: C300.1 C302.1 C303.2 C304.2 C305.1 C306.2 C307.1 C308.2 C309.1 C310.2 C311.2 C312.1 C313.1 C314.1 C315.2 C316.2 C317.1 C318.2 C319.2 C320.2 C321.2 C322.2 D301.2 D302.2 D303.2 D304.2 D305.2 L302.3 R300.2 R304.1 TP300.1 TP301.1 TP302.1 TP303.1 TP310.1 TP311.1 TP312.1 TP313.1 TP314.1 TP315.1 U300.1(GND) U301.2(GND) U302.3(GND) U303.1(GND)
ALPHS_EN: R300.1 TP304.1 U301.3(EN/UVLO) ; port ALPHS_EN
NetC302_2: C302.2 L300.2 U300.3(VIN)
NetC309_2: C309.2 U302.8(SS/TR)
NetC310_1: C310.1 U301.4(CT)
NetC314_2: C314.2 L301.2 U303.3(VIN)
NetD300_2: D300.2 J300.1 L302.2
NetD301_1: D301.1 R302.1
NetD302_1: D302.1 R305.1
NetD303_1: D303.1 R306.1
NetD304_1: D304.1 R307.1
NetD305_1: D305.1 R308.1
NetD306_2: D306.2(A) L302.4
NetR301_1: R301.1 U302.7(PG)
NetR303_1: R303.1 R304.2 U302.6(FB)

### Notes on the sheet
- +3V3 feeds digital sensors, MCU, MicroSD card
- +5V for sensor amplifiers
- Power Control for APLHS Sensors
- LED Blue
- Title
- Size:
- Date:
- A4
- Number:
- Time:
- Revision:
- Sheet
- of
- File:

### Library data of the parts
C300 C302 C305 C307 C312-C314 C317 = 4.7uF_0402_16V: Cap,4.7uF,16V,20%,X5R,0402; Manufacturer Part Number: CL05A475MO5NUNC; Manufacturer: Samsung Electro-Mechanics; Value: 4u7; Supplier 1: Digi-Key; Supplier Part Number 1: 1276-6836-1-ND
  C305 C313: Parameter 1: *
C303 C304 C315 C321 C322 = 4.7uF_0603_10V: Manufacturer Part Number: GRM21BR61E226ME44K; Manufacturer: Murata; ComponentLink1URL: http://www.murata.com/~/media/webrenewal/support/library/catalog/products/capacitor/mlcc/c02e.pdf; ComponentLink1Description: http://www.murata.com/~/media/webrenewal/support/library/catalog/products/capacitor/mlcc/c02e.pdf; Supplier 1: Digi-Key; Supplier Part Number 1: 490-14661-1-ND
C306 C311 C318 = 4.7uF_0603_10V: as C405 on sheet Sensors; ComponentLink1URL: http://www.murata.com/~/media/webrenewal/support/library/catalog/products/capacitor/mlcc/c02e.pdf; ComponentLink1Description: http://www.murata.com/~/media/webrenewal/support/library/catalog/products/capacitor/mlcc/c02e.pdf; Supplier 1: Digi-Key; Supplier Part Number 1: 1276-1043-1-ND
C308 C319 = 4.7uF_0603_10V: Manufacturer Part Number: CL05B153KO5NNNC; Manufacturer: Samsung; ComponentLink1URL: http://www.murata.com/~/media/webrenewal/support/library/catalog/products/capacitor/mlcc/c02e.pdf; ComponentLink1Description: http://www.murata.com/~/media/webrenewal/support/library/catalog/products/capacitor/mlcc/c02e.pdf; Supplier 1: Digi-Key; Supplier Part Number 1: 1276-1524-1-ND
C309 = 3.3nF_0603_50V: Cap,3.3nF,50V,10%,X7R,0603; Manufacturer: Samsung; Manufacturer Part Number: CL10B332KB8NNNC; Value: 3n3; Supplier 1: Digi-Key; Supplier Part Number 1: 1276-1758-1-ND; Voltage: 50V
C310 = 4.7uF_0603_10V: Voltage: N/A; ComponentLink1URL: http://www.murata.com/~/media/webrenewal/support/library/catalog/products/capacitor/mlcc/c02e.pdf; ComponentLink1Description: http://www.murata.com/~/media/webrenewal/support/library/catalog/products/capacitor/mlcc/c02e.pdf; Manufacturer Part Number: N/A; Manufacturer: N/A; Supplier 1: N/A; Supplier Part Number 1: N/A
C316 C320 = 4.7uF_0603_10V: Manufacturer Part Number: GRM32ER61A107ME20L; Manufacturer: Murata; ComponentLink1URL: http://www.murata.com/~/media/webrenewal/support/library/catalog/products/capacitor/mlcc/c02e.pdf; ComponentLink1Description: http://www.murata.com/~/media/webrenewal/support/library/catalog/products/capacitor/mlcc/c02e.pdf; Supplier 1: Digi-Key; Supplier Part Number 1: 490-9969-1-ND
D300 = NXP PTVSxS1UR-Series: Manufacturer: Nexperia; Manufacturer Part Number: PTVS12VS1UR,115; Supplier 1: Digi-Key; Supplier Part Number 1: 1727-5325-1-ND
D301 = SMLE12BC7TT86: LED Blue Diffused 0603; Manufacturer: Rohm; Forward (Drive) Current: 5 mA; Forward Voltage: 2.2 V; Supplier 1: Digi-Key; Manufacturer Part Number: SMLE12BC7TT86; Color: Blue; Dimension: 0603; ComponentLink1URL: https://datasheet.ciiva.com/11774/0900766b80df3ada-11774260.pdf; ComponentLink1Description: https://datasheet.ciiva.com/11774/0900766b80df3ada-11774260.pdf; ComponentLink2URL: https://datasheet.ciiva.com/3161/sml-d1-3161419.pdf; ComponentLink2Description: https://datasheet.ciiva.com/3161/sml-d1-3161419.pdf; ComponentLink3URL: https://datasheet.ciiva.com/2110/sml-d1-2110396.pdf; ComponentLink3Description: https://datasheet.ciiva.com/2110/sml-d1-2110396.pdf; ComponentLink4URL: https://datasheet.ciiva.com/2110/sml-d1-2110397.pdf; ComponentLink4Description: https://datasheet.ciiva.com/2110/sml-d1-2110397.pdf; ComponentLink5URL: https://datasheet.ciiva.com/2110/sml-d1-2110398.pdf; ComponentLink5Description: https://datasheet.ciiva.com/2110/sml-d1-2110398.pdf; Supplier Part Number 1: 511-1589-1-ND
D302-D305 = Green LED: as D407 on sheet Sensors; Supplier 1: Digi-Key; Stock 1: 105158; Pricing 1: 1=0.34, 10=0.251, 25=0.1848, 100=0.132, 250=0.0898, 500=0.0792, 1000=0.062 (USD); Color: Green; Dimension: 0603; Lens Type: Diffused; ComponentLink1URL: https://datasheet.ciiva.com/11774/0900766b80df3ada-11774260.pdf; ComponentLink1Description: https://datasheet.ciiva.com/11774/0900766b80df3ada-11774260.pdf; ComponentLink2URL: https://datasheet.ciiva.com/3161/sml-d1-3161419.pdf; ComponentLink2Description: https://datasheet.ciiva.com/3161/sml-d1-3161419.pdf; ComponentLink3URL: https://datasheet.ciiva.com/2110/sml-d1-2110396.pdf; ComponentLink3Description: https://datasheet.ciiva.com/2110/sml-d1-2110396.pdf; ComponentLink4URL: https://datasheet.ciiva.com/2110/sml-d1-2110397.pdf; ComponentLink4Description: https://datasheet.ciiva.com/2110/sml-d1-2110397.pdf; ComponentLink5URL: https://datasheet.ciiva.com/2110/sml-d1-2110398.pdf; ComponentLink5Description: https://datasheet.ciiva.com/2110/sml-d1-2110398.pdf; Supplier Part Number 1: 511-1578-1-ND; Digikey PN: 511-1578-1-ND
D306 = MURA260T3G: Diode Standard 600V 2A Surface Mount SMA; Manufacturer: ON Semi; Properties: 2A/600V; Supplier Part Number 1: MURA260T3GOSCT-ND; Supplier 1: Digi-Key; Package: SMA; Manufacturer Part Number: MURA260T3G
J300 = TERM BLOCK 2POS 45DEG 5.08MM: 5.08mm Spring Cage, Tension Clamp, Pheonix Contact, 2pos, THD; Manufacturer: Phoenix Contact; Supplier Part Number 1: 277-6722-ND; Manufacturer Part Number: 1790283; Supplier 1: Digi-Key
L300 L301 = Ferrite_MH2029_0805: as L400 on sheet Sensors; Supplier 1: Digi-Key; Supplier Part Number 1: MH2029-300YCT-ND; RoHS: RoHS Compliant; Category: Filters; Stock: 27744; Pricing: 1=0.14, 10=0.087, 25=0.08, 50=0.072, 100=0.0529, 250=0.03844, 500=0.03524, 1000=0.03043 (CAD); Packaging: Cut Tape (CT); Current Rating (Max): 3A; Ratings: -; Operating Temperature: -55°C ~ 125°C; Package / Case: 0805 (2012 Metric); Mounting Type: Surface Mount; Height (Max): 0.043" (1.10mm); Size / Dimension: 0.079" L x 0.047" W (2.00mm x 1.20mm); ComponentLink1URL: http://www.bourns.com/docs/Product-Datasheets/mh.pdf; ComponentLink1Description: http://www.bourns.com/docs/Product-Datasheets/mh.pdf; Supplier 2: Arrow; Supplier Part Number 2: m2dWQtYZmUCQVruAmfTV4mDHm8tZpH9KPPdphe4ib-E; Package Quantity: 1; ComponentLink2URL: https://www.arrow.com/en/products/mh2029-300y/bourns/; ComponentLink2Description: https://www.arrow.com/en/products/mh2029-300y/bourns/
L302 = CM3421Y600R-10: 2 Line Common Mode Choke Surface Mount 60 Ohms @ 100MHz 15A DCR 0.75mOhm; Manufacturer: Laird; Manufacturer Part Number: CM3421Y600R-10; Value: *; Supplier 1: Digi-Key; Supplier Part Number 1: 240-2501-1-ND
R300 = RES: GENERAL: as R400 on sheet Sensors; Accuracy: *; Distributor Part Number: *; Power: *; Type: *; Distributor: Digi-Key; Package: *; Supplier 1: Digi-Key; Supplier Part Number 1: P10.0KLCT-ND
R301 = 100K_0603_0.1W: Res,SMD,0603,1/10W,100K,1%; Manufacturer: Panasonic; Manufacturer Part Number: ERJ-2RKF1003X; Supplier 1: Digi-Key; ComponentLink1URL: http://industrial.panasonic.com/www-cgi/jvcr13pz.cgi?E+PZ+3+AOA0002+ERJ3EKF1003V+7+WW; ComponentLink1Description: http://industrial.panasonic.com/www-cgi/jvcr13pz.cgi?E+PZ+3+AOA0002+ERJ3EKF1003V+7+WW; ComponentLink2URL: https://www.arrow.com/en/products/erj3ekf1003v/panasonic/; ComponentLink2Description: https://www.arrow.com/en/products/erj3ekf1003v/panasonic/; Supplier Part Number 1: P100KLCT-ND; Value: 100k
R302 R305 = 1K00_0603_0.1W: RES 1K Ohm ±5%, 0.25W,1/4W 0603; Manufacturer: Yageo; Manufacturer Part Number: RC0603FR-071K2L; Supplier 1: Digi-Key; Resistance (Ohms): 1k; ComponentLink1URL: https://datasheet.ciiva.com/2469/esr-2469603.pdf; ComponentLink1Description: https://datasheet.ciiva.com/2469/esr-2469603.pdf; ComponentLink2URL: https://datasheet.ciiva.com/2469/esr-2469604.pdf; ComponentLink2Description: https://datasheet.ciiva.com/2469/esr-2469604.pdf; ComponentLink3URL: https://datasheet.ciiva.com/2469/esr-2469605.pdf; ComponentLink3Description: https://datasheet.ciiva.com/2469/esr-2469605.pdf; Supplier Part Number 1: 311-1.20KHRCT-ND
R303 = 71K5_0603_1/10W: RES SMD 71.5K OHM 1% 1/10W 0603; Manufacturer Part Number: ERJ-2RKF7152X; Manufacturer: Panasonic Electronic Components; Supplier 1: Digi-Key; Supplier Part Number 1: P71.5KLCT-ND
R304 = 1K00_0603_0.1W: as R404 on sheet Sensors; ComponentLink1URL: https://datasheet.ciiva.com/2469/esr-2469603.pdf; ComponentLink1Description: https://datasheet.ciiva.com/2469/esr-2469603.pdf; ComponentLink2URL: https://datasheet.ciiva.com/2469/esr-2469604.pdf; ComponentLink2Description: https://datasheet.ciiva.com/2469/esr-2469604.pdf; ComponentLink3URL: https://datasheet.ciiva.com/2469/esr-2469605.pdf; ComponentLink3Description: https://datasheet.ciiva.com/2469/esr-2469605.pdf; Value: 10k; Supplier 1: Digi-Key; Supplier Part Number 1: P10.0KLCT-ND
R306 R307 = 1K00_0603_0.1W: RES 1K Ohm ±5%, 0.25W,1/4W 0603; Manufacturer: Rohm; Manufacturer Part Number: RC0603FR-07560RL; Supplier 1: Digi-Key; Resistance (Ohms): 1k; ComponentLink1URL: https://datasheet.ciiva.com/2469/esr-2469603.pdf; ComponentLink1Description: https://datasheet.ciiva.com/2469/esr-2469603.pdf; ComponentLink2URL: https://datasheet.ciiva.com/2469/esr-2469604.pdf; ComponentLink2Description: https://datasheet.ciiva.com/2469/esr-2469604.pdf; ComponentLink3URL: https://datasheet.ciiva.com/2469/esr-2469605.pdf; ComponentLink3Description: https://datasheet.ciiva.com/2469/esr-2469605.pdf; Supplier Part Number 1: 311-560HRCT-ND
R308 = 1K00_0603_0.1W: RES 1K Ohm ±5%, 0.25W,1/4W 0603; Manufacturer: Rohm; Manufacturer Part Number: RC0603FR-07330RL; Value: 330R; Supplier 1: Digi-Key; Resistance (Ohms): 1k; ComponentLink1URL: https://datasheet.ciiva.com/2469/esr-2469603.pdf; ComponentLink1Description: https://datasheet.ciiva.com/2469/esr-2469603.pdf; ComponentLink2URL: https://datasheet.ciiva.com/2469/esr-2469604.pdf; ComponentLink2Description: https://datasheet.ciiva.com/2469/esr-2469604.pdf; ComponentLink3URL: https://datasheet.ciiva.com/2469/esr-2469605.pdf; ComponentLink3Description: https://datasheet.ciiva.com/2469/esr-2469605.pdf; Supplier Part Number 1: 311-330HRCT-ND
TP300-TP315 = TP_SMD_39MIL: as TP400 on sheet Sensors; Fast Supplier: No P/N Required; Fast Supplier P/N: No P/N Required; Manufacturer P/N: No P/N Required
U300 U303 = ZLDO1117: 1A 3.3V LDO; Manufacturer: Diodes Incorporated; Supplier 1: Digi-Key
  U300: Manufacturer Part Number: ZLDO1117G50TA; Supplier Part Number 1: ZLDO1117G50DICT-ND
  U303: Manufacturer Part Number: ZLDO1117QG33TA; Supplier Part Number 1: ZLDO1117QG33TADICT-ND
U301 = TPS22810DBVR: High Side Load Switch; Manufacturer: Texas Instruments; Supplier 1: Digi-Key; Manufacturer Part Number: TPS22810DBVR; Supplier Part Number 1: 296-45297-1-ND
U302 = TPS82140: DC-DC: 0.9-6V 2A output, 3-17V input. Non-isolated.; Manufacturer: Texas Instruments; Manufacturer Part Number: TPS82140SILT; Supplier 1: Digi-Key; Supplier Part Number 1: 296-47089-1-ND; ComponentLink1Description: wefwef; ComponentLink1URL: https://www.digikey.ca/product-detail/en/texas-instruments/TPS82140SILT/296-47089-1-ND/7596470